# Altium project PCB_RobotLine.PrjPcb (part 2 of 2)

## Sheet SheetSensor.SchDoc
size A3; DocumentNumber: 4; SheetNumber: 4; SheetTotal: 5
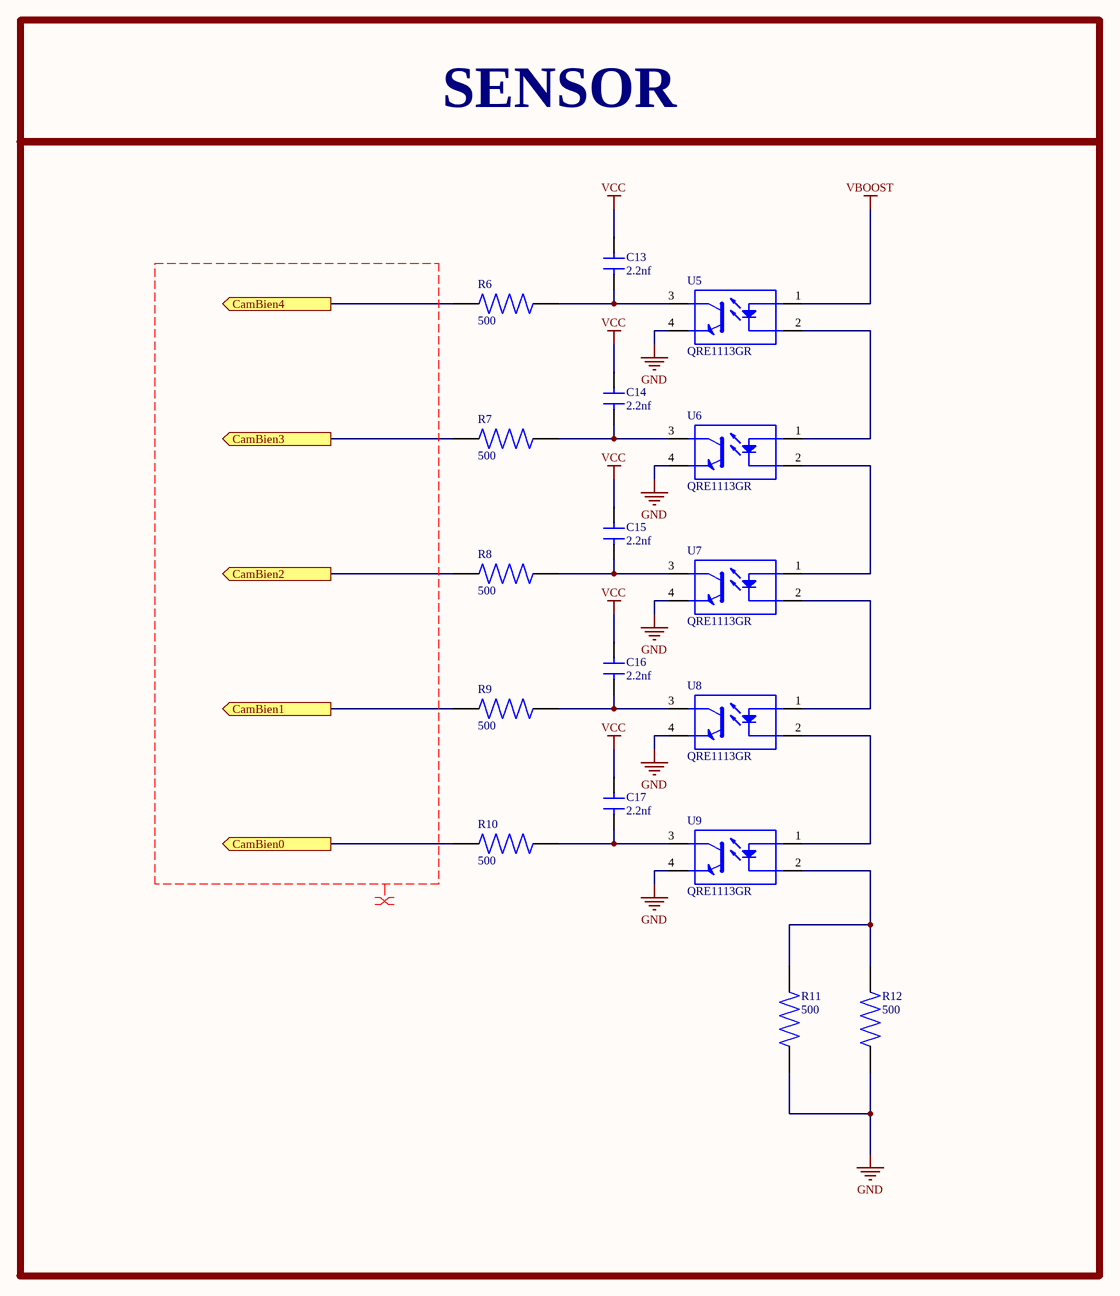
[diagram p4: SheetSensor.SchDoc]

### Parts
C13  2.2nf  [C0805 30PF 50V]
C14  2.2nf  [C0805 30PF 50V]
C15  2.2nf  [C0805 30PF 50V]
C16  2.2nf  [C0805 30PF 50V]
C17  2.2nf  [C0805 30PF 50V]
R6  500  [C0805R500]
R7  500  [C0805R500]
R8  500  [C0805R500]
R9  500  [C0805R500]
R10  500  [C0805R500]
R11  500  [C0805R500]
R12  500  [C0805R500]
U5  QRE1113GR  [SOIC180P460X187-4N]
U6  QRE1113GR  [SOIC180P460X187-4N]
U7  QRE1113GR  [SOIC180P460X187-4N]
U8  QRE1113GR  [SOIC180P460X187-4N]
U9  QRE1113GR  [SOIC180P460X187-4N]

### Ports
CamBien0 (out), CamBien1 (out), CamBien2 (out), CamBien3 (out), CamBien4 (out)

### Nets
GND: R11.1 R12.1 U5.4 U6.4 U7.4 U8.4 U9.4
VBOOST: U5.1
VCC: C13.2 C14.2 C15.2 C16.2 C17.2
NetC13_1: C13.1 R6.2 U5.3
NetC14_1: C14.1 R7.2 U6.3
NetC15_1: C15.1 R8.2 U7.3
NetC16_1: C16.1 R9.2 U8.3
NetC17_1: C17.1 R10.2 U9.3
NetR6_1: R6.1 ; port CamBien4
NetR7_1: R7.1 ; port CamBien3
NetR8_1: R8.1 ; port CamBien2
NetR9_1: R9.1 ; port CamBien1
NetR10_1: R10.1 ; port CamBien0
NetR11_2: R11.2 R12.2 U9.2
NetU5_2: U5.2 U6.1
NetU6_2: U6.2 U7.1
NetU7_2: U7.2 U8.1
NetU8_2: U8.2 U9.1

### Layout directives
net class CamBien: (no net found under the mark)

### Notes on the sheet
- SENSOR

### Library data of the parts
C13-C17 = C0805 2.2nf 50v
R6-R12 = PLT0805Z5000AST5: RES SMD 500 OHM 0.05% 1/4W 0805; Manufacturer: Vishay Dale Thin Film; Resistance: 500R; Power Rating: 250mW; Voltage Rating: 100V; Temperature Coefficient: 5ppm/°C; Supplier 1: Digi-Key; Manufacturer Part Number: PLT0805Z5000AST5; Stock 1: 7300; Pricing 1: 1 = 3.70000, 10 = 3.30000, 100 = 2.44200 (USD); RoHS: Yes; Case/Package: 0805; Case Code (Imperial): 0805; Case Code (Metric): 2012; Weight: 0.000194oz; Min Operating Temperature: -55°C; Max Operating Temperature: 125°C; Packaging: Tape and Reel; Package Quantity: 1; Termination: SMD/SMT; Resistor Type: Thin Film; Number of Terminations: 2; Max Power Dissipation: 250mW; Features: Moisture Resistant; Series: PLT; Length: 0.08inch; Width: 0.05inch; Height: 0.033inch; Radiation Hardening: No; RoHS Compliant: Yes; ComponentLink1URL: https://datasheet.ciiva.com/2485/plt-2485163.pdf?src-supplier=Digi-Key; ComponentLink1Description: https://datasheet.ciiva.com/2485/plt-2485163.pdf?src-supplier=Digi-Key; ComponentLink2URL: https://datasheet.ciiva.com/2485/plt-2485164.pdf?src-supplier=Digi-Key; ComponentLink2Description: https://datasheet.ciiva.com/2485/plt-2485164.pdf?src-supplier=Digi-Key; ComponentLink3URL: https://datasheet.ciiva.com/2485/plt-2485165.pdf?src-supplier=Digi-Key; ComponentLink3Description: https://datasheet.ciiva.com/2485/plt-2485165.pdf?src-supplier=Digi-Key; Supplier Part Number 1: PLT0805-500ACT-ND
U5-U9 = QRE1113GR: Photointerrupter Reflective Phototransistor 4-Pin Miniature SMT T/R; Manufacturer: ON Semiconductor / Fairchild; Number of Channels: 1; Wavelength: 940nm; Reverse Breakdown Voltage: 5V; Forward Current: 50mA; Rise Time: 20us; Forward Voltage: 1.2V; Sensing Distance: 0.197inch; Collector Emitter Voltage (VCEO): 30V; Max Collector Current: 20mA; Power Dissipation: 75mW; Operating Supply Voltage: 1.7V; Supplier 1: Digi-Key; Manufacturer Part Number: QRE1113GR; Stock 1: 0; RoHS: Yes; Mount: Surface Mount; Case/Package: SMD/SMT; Number of Pins: 4; Weight: 0.078g; Contact Plating: Tin,Matte; Min Operating Temperature: -40°C; Max Operating Temperature: 85°C; Packaging: Tape and Reel; Package Quantity: 1000; Fall Time: 20us; Reverse Voltage (DC): 5V; Collector Emitter Breakdown Voltage: 30V; Response Time: 20us; Max Breakdown Voltage: 30V; Number of Elements: 1; Input Current: 50mA; Max Power Dissipation: 75mW; Output Type: Phototransistor; Length: 3.6mm; Width: 2.9mm; Height: 1.7mm; Radiation Hardening: No; REACH SVHC: No SVHC; Lead Free: Lead Free; RoHS Compliant: Yes; ComponentLink1URL: https://datasheet.ciiva.com/15116/getdatasheetpartid-146181-15116981.pdf?src-supplier=Verical; ComponentLink1Description: https://datasheet.ciiva.com/15116/getdatasheetpartid-146181-15116981.pdf?src-supplier=Verical; ComponentLink2URL: https://datasheet.ciiva.com/8074/1725706-8074165.pdf?src-supplier=Element14; ComponentLink2Description: https://datasheet.ciiva.com/8074/1725706-8074165.pdf?src-supplier=Element14; ComponentLink3URL: https://datasheet.ciiva.com/8273/qre1113-8273303.pdf?src-supplier=Avnet; ComponentLink3Description: https://datasheet.ciiva.com/8273/qre1113-8273303.pdf?src-supplier=Avnet; ComponentLink4URL: https://datasheet.ciiva.com/26228/qre1113-26228935.pdf?src-supplier=Avnet+Europe; ComponentLink4Description: https://datasheet.ciiva.com/26228/qre1113-26228935.pdf?src-supplier=Avnet+Europe; ComponentLink5URL: https://datasheet.ciiva.com/2823/qre1113-2823864.pdf?src-supplier=Digi-Key; ComponentLink5Description: https://datasheet.ciiva.com/2823/qre1113-2823864.pdf?src-supplier=Digi-Key; ComponentLink6URL: https://datasheet.ciiva.com/2823/qre1113-2823865.pdf?src-supplier=Digi-Key; ComponentLink6Description: https://datasheet.ciiva.com/2823/qre1113-2823865.pdf?src-supplier=Digi-Key; ComponentLink7URL: https://datasheet.ciiva.com/2823/qre1113-2823866.pdf?src-supplier=Digi-Key; ComponentLink7Description: https://datasheet.ciiva.com/2823/qre1113-2823866.pdf?src-supplier=Digi-Key; ComponentLink8URL: https://datasheet.ciiva.com/3305/qre1113-3305755.pdf?src-supplier=Avnet; ComponentLink8Description: https://datasheet.ciiva.com/3305/qre1113-3305755.pdf?src-supplier=Avnet; Supplier Part Number 1: QRE1113GRCT-ND

## Nets that join several sheets
GND: SheetPower (10 pins), SheetMotor (5 pins), SheetMicrocontroller (18 pins), SheetSensor (7 pins)
VBOOST: SheetPower (5 pins), SheetMotor (U2.13 U2.14 U2.24), SheetSensor (U5.1)
VCC: SheetPower (C8.2 R13.2 U3.3), SheetMotor (U2.15 U2.19 U2.20 U2.23), SheetMicrocontroller (14 pins), SheetSensor (5 pins)
NetR6_1: SheetMicrocontroller (U1.24), SheetSensor (R6.1)
NetR7_1: SheetMicrocontroller (U1.22), SheetSensor (R7.1)
NetR8_1: SheetMicrocontroller (U1.21), SheetSensor (R8.1)
NetR9_1: SheetMicrocontroller (U1.20), SheetSensor (R9.1)
NetR10_1: SheetMicrocontroller (U1.19), SheetSensor (R10.1)
NetU1_35: SheetMotor (U2.22), SheetMicrocontroller (U1.35)
NetU1_36: SheetMotor (U2.17), SheetMicrocontroller (U1.36)
NetU1_38: SheetMotor (U2.16), SheetMicrocontroller (U1.38)
NetU1_40: SheetMotor (U2.21), SheetMicrocontroller (U1.40)